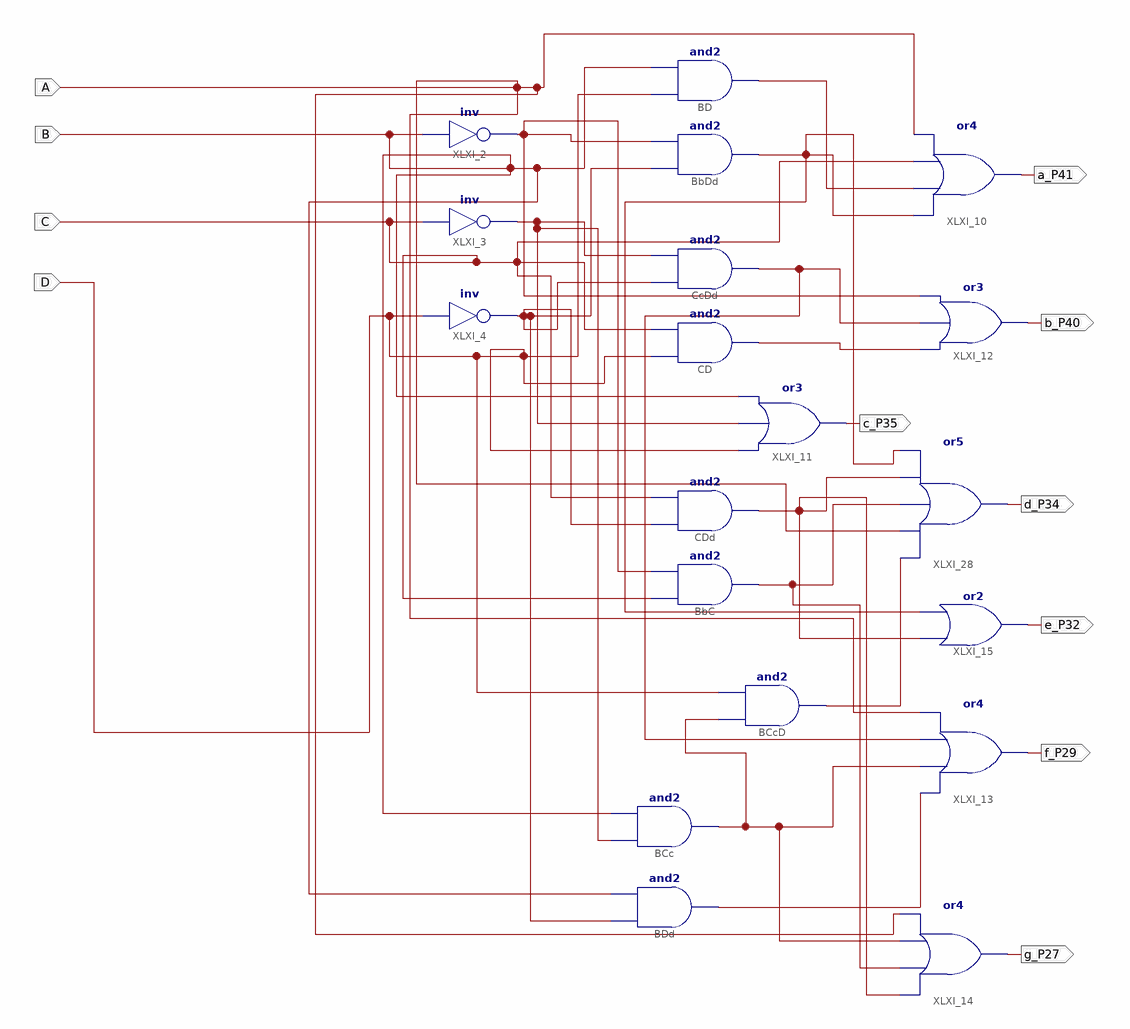
[diagram p0: schematic sheet 1]
// Xilinx ISE schematic bcd_to_7seg.sch (spartan6) as structural Verilog: 19 symbols, 11 ports
module bcd_to_7seg (
  input  A,
  input  B,
  input  C,
  input  D,
  output a_P41,
  output b_P40,
  output c_P35,
  output f_P29,
  output g_P27,
  output e_P32,
  output d_P34
);

  wire XLXN_23, XLXN_24, XLXN_26, XLXN_27, XLXN_28, XLXN_31, XLXN_32, XLXN_33, XLXN_34, XLXN_35, XLXN_36,
       XLXN_37;

  and BD (XLXN_23, D, B);
  and BbDd (XLXN_31, XLXN_35, XLXN_24);
  and CcDd (XLXN_26, XLXN_35, XLXN_28);
  and CD (XLXN_27, D, C);
  and CDd (XLXN_34, XLXN_35, C);
  and BbC (XLXN_32, C, XLXN_24);
  and BCcD (XLXN_33, XLXN_37, D);
  and BCc (XLXN_37, XLXN_28, B);
  and BDd (XLXN_36, XLXN_35, B);
  or XLXI_10 (a_P41, XLXN_31, XLXN_23, C, A);
  or XLXI_11 (c_P35, D, XLXN_28, B);
  or XLXI_12 (b_P40, XLXN_27, XLXN_26, XLXN_24);
  or XLXI_13 (f_P29, XLXN_36, XLXN_37, XLXN_26, A);
  or XLXI_14 (g_P27, XLXN_34, XLXN_32, XLXN_37, A);
  or XLXI_15 (e_P32, XLXN_34, XLXN_31);
  not XLXI_4 (XLXN_35, D);
  not XLXI_2 (XLXN_24, B);
  not XLXI_3 (XLXN_28, C);
  or XLXI_28 (d_P34, XLXN_33, A, XLXN_32, XLXN_34, XLXN_31);
endmodule
